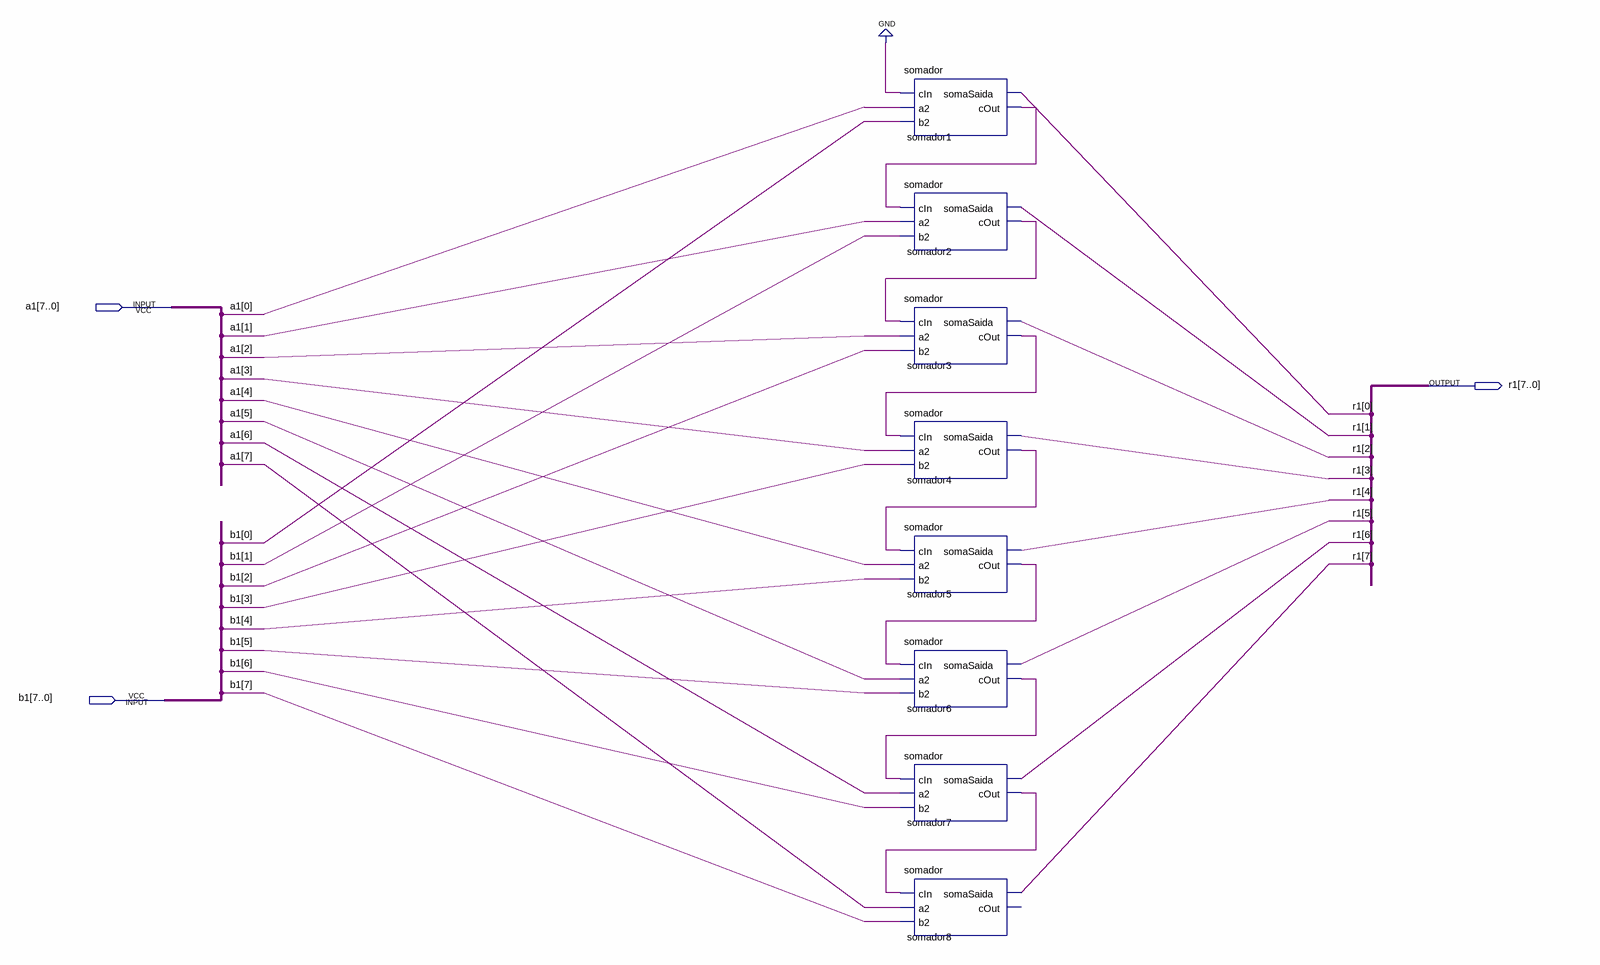
[diagram p0: schematic sheet]
// Quartus schematic somador_completo.bdf as structural Verilog: 8 symbols, 3 pins
module somador_completo (
  input  [7:0] a1,
  input  [7:0] b1,
  output [7:0] r1
);

  wire somador1_cout, somador2_cout, somador3_cout, somador4_cout, somador5_cout, somador6_cout,
       somador7_cout;

  somador somador1 (.cIn(1'b0), .a2(a1[0]), .b2(b1[0]), .somaSaida(r1[0]), .cOut(somador1_cout));
  somador somador2 (.cIn(somador1_cout), .a2(a1[1]), .b2(b1[1]), .somaSaida(r1[1]), .cOut(somador2_cout));
  somador somador3 (.cIn(somador2_cout), .a2(a1[2]), .b2(b1[2]), .somaSaida(r1[2]), .cOut(somador3_cout));
  somador somador4 (.cIn(somador3_cout), .a2(a1[3]), .b2(b1[3]), .somaSaida(r1[3]), .cOut(somador4_cout));
  somador somador5 (.cIn(somador4_cout), .a2(a1[4]), .b2(b1[4]), .somaSaida(r1[4]), .cOut(somador5_cout));
  somador somador6 (.cIn(somador5_cout), .a2(a1[5]), .b2(b1[5]), .somaSaida(r1[5]), .cOut(somador6_cout));
  somador somador7 (.cIn(somador6_cout), .a2(a1[6]), .b2(b1[6]), .somaSaida(r1[6]), .cOut(somador7_cout));
  somador somador8 (.cIn(somador7_cout), .a2(a1[7]), .b2(b1[7]), .somaSaida(r1[7]));  // open: cOut
endmodule
